# Altium schematic sheet 走线图3.SchDoc
size A3; PageSetup: Record=PageOptions|CenterHorizontal=True|CenterVertical=True|PrintScale=0.72|XCorrection=1.00|YCorrection=1.00|PrintKind=1|BorderSize=5000000|LeftOffset=0|BottomOffset=0|Orientation=1|PaperLength=1000|PaperWidth=1000|Scale=100|PaperSource=260|PrintQuality=600|MediaType=1|DitherType=10|PaperKind=A3|PrintScaleMode=1
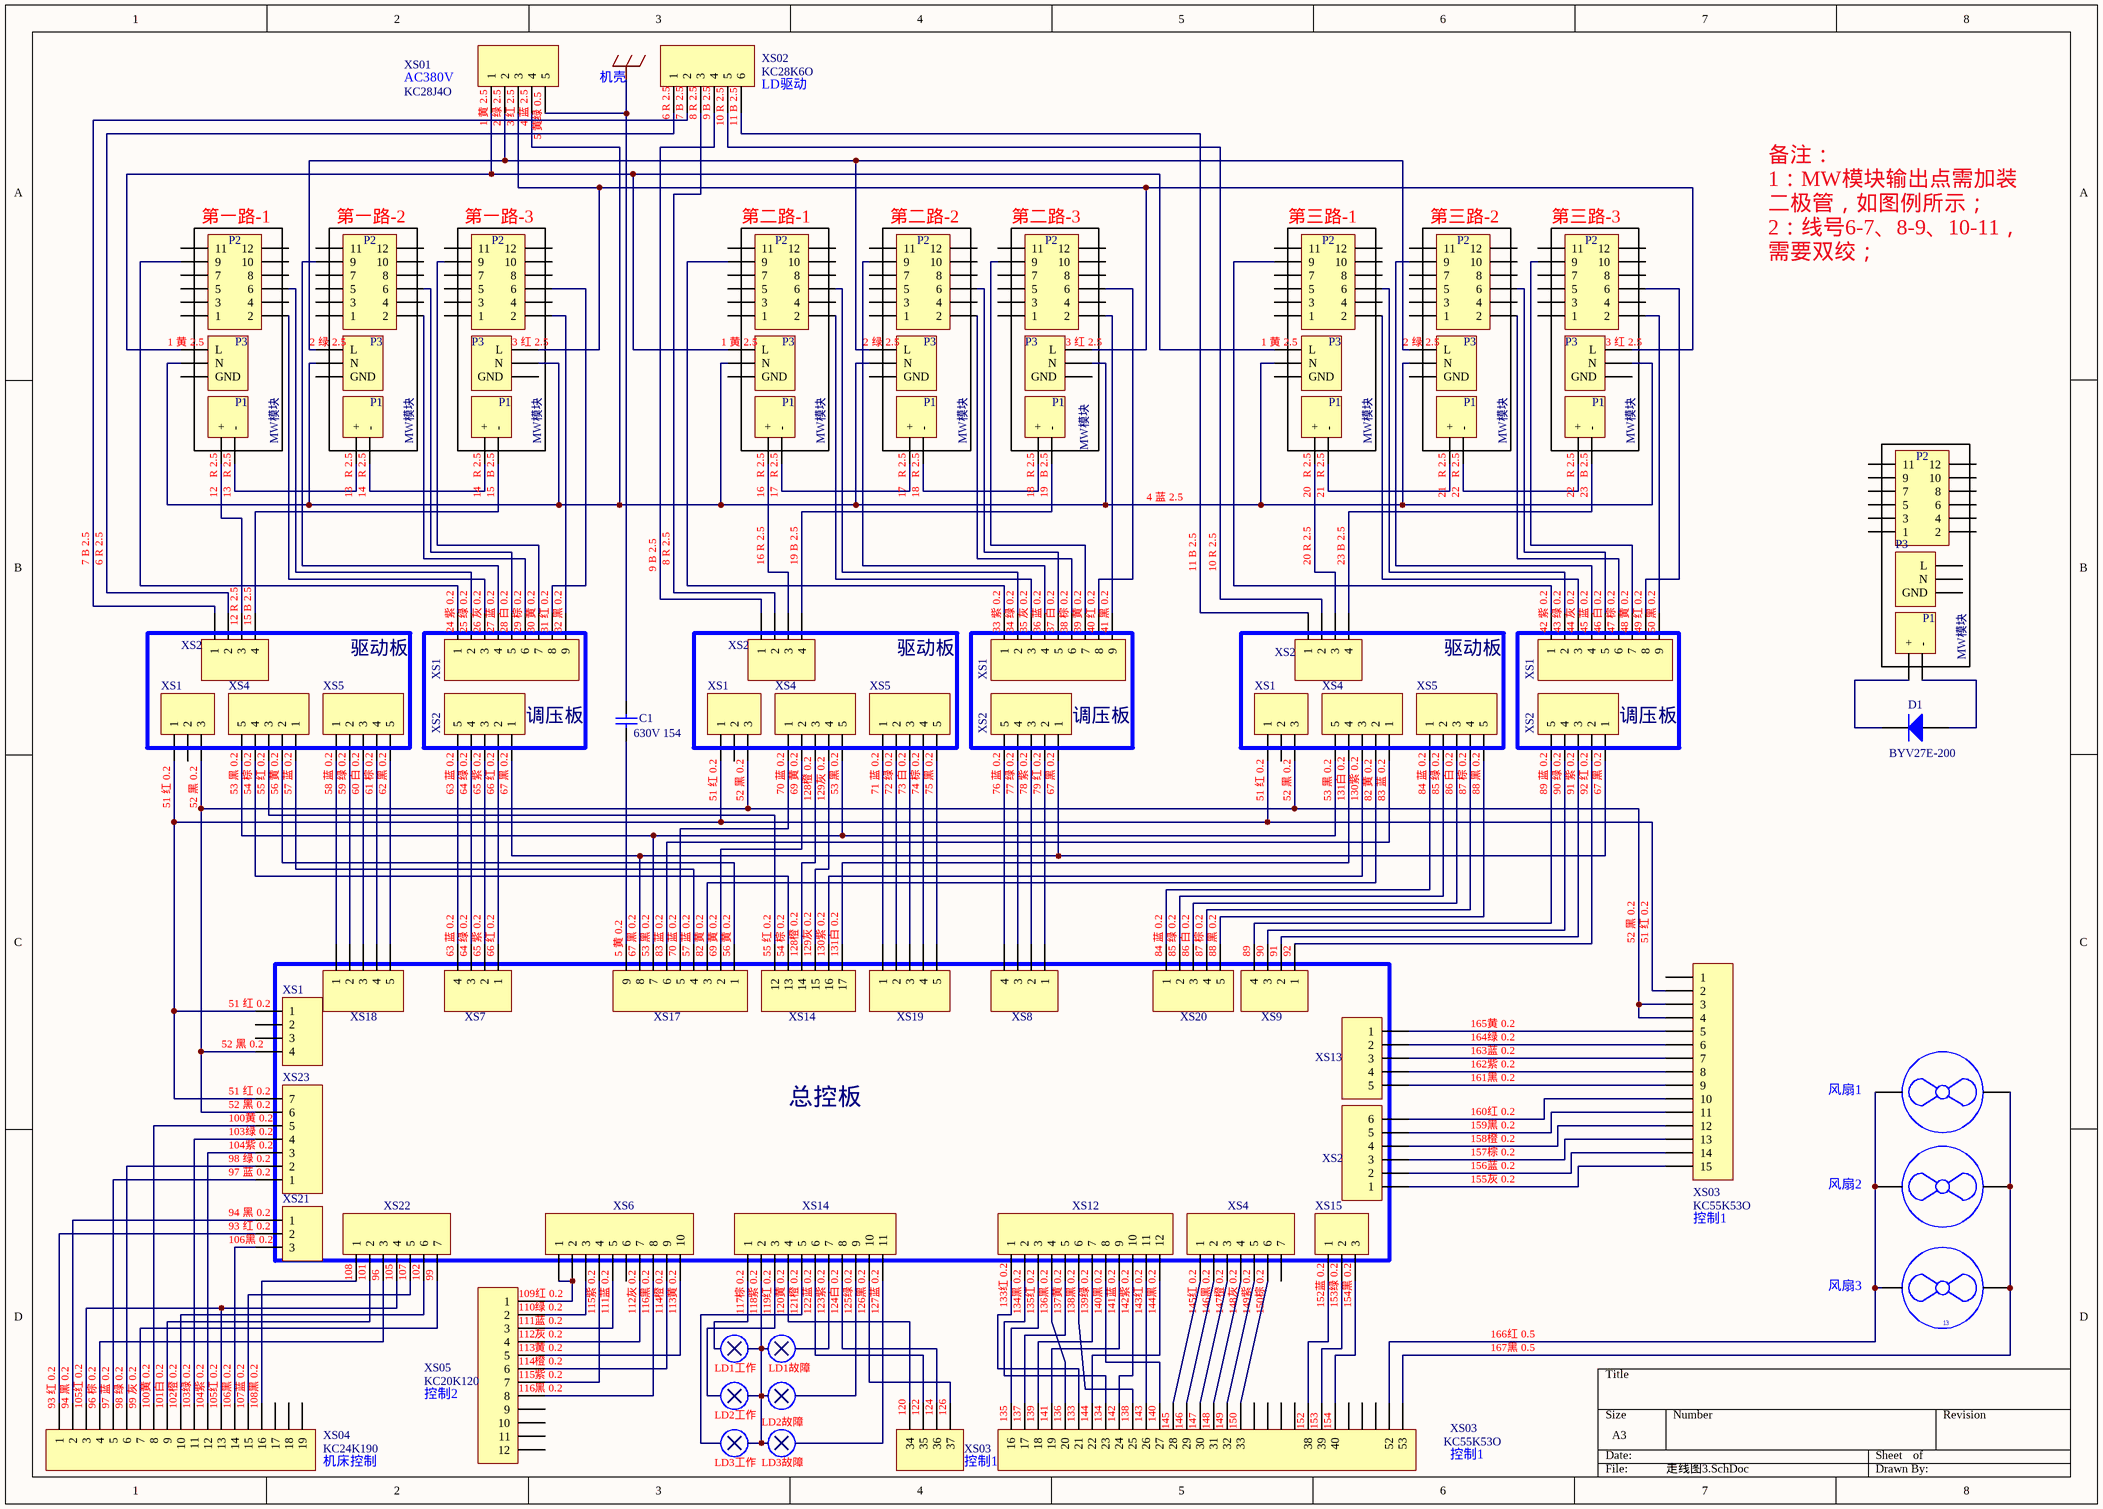
[diagram p0: 走线图3.SchDoc]

## Parts
(Parts that share a designator on the sheet are numbered #1, #2 ... from top to bottom, then left to right.)
?#1  (no value)
?#2  (no value)
?#3  (no value)
C1  value 630V 154  [RAD-0.3]  (hidden comment: Cap)
D1  BYV27E-200  [DIO18.84-9.6x5.6]
P1#1  Header 2  [HDR1X2]  (value not drawn)
P1#2  Header 2  [HDR1X2]  (value not drawn)
P1#3  Header 2  [HDR1X2]  (value not drawn)
P1#4  Header 2  [HDR1X2]  (value not drawn)
P1#5  Header 2  [HDR1X2]  (value not drawn)
P1#6  Header 2  [HDR1X2]  (value not drawn)
P1#7  Header 2  [HDR1X2]  (value not drawn)
P1#8  Header 2  [HDR1X2]  (value not drawn)
P1#9  Header 2  [HDR1X2]  (value not drawn)
P1#10  Header 2  [HDR1X2]  (value not drawn)
P2#1  Header 6X2H  [HDR2X6H]  (value not drawn)
P2#2  Header 6X2H  [HDR2X6H]  (value not drawn)
P2#3  Header 6X2H  [HDR2X6H]  (value not drawn)
P2#4  Header 6X2H  [HDR2X6H]  (value not drawn)
P2#5  Header 6X2H  [HDR2X6H]  (value not drawn)
P2#6  Header 6X2H  [HDR2X6H]  (value not drawn)
P2#7  Header 6X2H  [HDR2X6H]  (value not drawn)
P2#8  Header 6X2H  [HDR2X6H]  (value not drawn)
P2#9  Header 6X2H  [HDR2X6H]  (value not drawn)
P2#10  Header 6X2H  [HDR2X6H]  (value not drawn)
P3#1  Header 3  [HDR1X3]  (value not drawn)
P3#2  Header 3  [HDR1X3]  (value not drawn)
P3#3  Header 3  [HDR1X3]  (value not drawn)
P3#4  Header 3  [HDR1X3]  (value not drawn)
P3#5  Header 3  [HDR1X3]  (value not drawn)
P3#6  Header 3  [HDR1X3]  (value not drawn)
P3#7  Header 3  [HDR1X3]  (value not drawn)
P3#8  Header 3  [HDR1X3]  (value not drawn)
P3#9  Header 3  [HDR1X3]  (value not drawn)
P3#10  Header 3  [HDR1X3]  (value not drawn)
XS01  KC28J4O  [HDR1X5]
XS1#1  Header 9  [HDR1X9]  (value not drawn)
XS1#2  Header 9  [HDR1X9]  (value not drawn)
XS1#3  Header 9  [HDR1X9]  (value not drawn)
XS1#4  Header 3  [HDR1X3]  (value not drawn)
XS1#5  Header 3  [HDR1X3]  (value not drawn)
XS1#6  Header 3  [HDR1X3]  (value not drawn)
XS1#7  Header 4  [HDR1X4]  (value not drawn)
XS02  KC28K6O  [HDR1X6]
XS2#1  Header 4  [HDR1X4]  (value not drawn)
XS2#2  Header 4  [HDR1X4]  (value not drawn)
XS2#3  Header 4  [HDR1X4]  (value not drawn)
XS2#4  Header 5  [HDR1X5]  (value not drawn)
XS2#5  Header 5  [HDR1X5]  (value not drawn)
XS2#6  Header 5  [HDR1X5]  (value not drawn)
XS2#7  Header 6  [HDR1X6]  (value not drawn)
XS03#1  KC55K53O  [HDR1X15]
XS03#2  Header 4  [HDR1X4]  (value not drawn)
XS03#3  KC55K53O  [HDR1X30]
XS04  KC24K190  [HDR1X19]
XS4#1  Header 5  [HDR1X5]  (value not drawn)
XS4#2  Header 5  [HDR1X5]  (value not drawn)
XS4#3  Header 5  [HDR1X5]  (value not drawn)
XS4#4  Header 7  [HDR1X7]  (value not drawn)
XS05  KC20K120  [HDR1X12]
XS5#1  Header 5  [HDR1X5]  (value not drawn)
XS5#2  Header 5  [HDR1X5]  (value not drawn)
XS5#3  Header 5  [HDR1X5]  (value not drawn)
XS6  Header 10  [HDR1X10]  (value not drawn)
XS7  Header 4  [HDR1X4]  (value not drawn)
XS8  Header 4  [HDR1X4]  (value not drawn)
XS9  Header 4  [HDR1X4]  (value not drawn)
XS12  Header 12  [HDR1X12]  (value not drawn)
XS13  Header 5  [HDR1X5]  (value not drawn)
XS14#1  Header 6  [HDR1X6]  (value not drawn)
XS14#2  Header 11  [HDR1X11]  (value not drawn)
XS15  Header 3  [HDR1X3]  (value not drawn)
XS17  Header 9  [HDR1X9]  (value not drawn)
XS18  Header 5  [HDR1X5]  (value not drawn)
XS19  Header 5  [HDR1X5]  (value not drawn)
XS20  Header 5  [HDR1X5]  (value not drawn)
XS21  Header 3  [HDR1X3]  (value not drawn)
XS22  Header 7  [HDR1X7]  (value not drawn)
XS23  Header 7  [HDR1X7]  (value not drawn)

## Blocks framed on the sheet
第一路-1: P1#1 P2#1 P3#1
第一路-2: P1#2 P2#2 P3#2
第一路-3: P1#3 P2#3 P3#3
第二路-1: P1#4 P2#4 P3#4
第二路-2: P1#5 P2#5 P3#5
第二路-3: P1#6 P2#6 P3#6
第三路-1: P1#7 P2#7 P3#7
第三路-2: P1#8 P2#8 P3#8
第三路-3: P1#9 P2#9 P3#9
驱动板: XS1#4 XS2#1 XS4#1 XS5#1
调压板: XS1#1 XS2#4
驱动板: XS1#5 XS2#2 XS4#2 XS5#2
调压板: XS1#2 XS2#5
驱动板: XS1#6 XS2#3 XS4#3 XS5#3
调压板: XS1#3 XS2#6
总控板: XS1#7 XS2#7 XS4#4 XS6-XS9 XS12 XS13 XS14#1 XS14#2 XS15 XS17-XS23

## Nets
VSS: C1.2 XS01.5
Net?#1_9: ?#1.9 ?#2.9 ?#3.9 XS03#3.29(52)
Net?#1_10: ?#1.10 ?#2.10 ?#3.10 XS03#3.30(53)
NetC1_1: C1.1 XS17.9
NetD1_1: D1.1(A) P1#10.2(-)
NetD1_2: D1.2(K) P1#10.1(+)
NetP1#1_1: P1#1.1(+) XS2#1.3
NetP1#1_2: P1#1.2(-) P1#2.1(+)
NetP1#2_2: P1#2.2(-) P1#3.1(+)
NetP1#3_2: P1#3.2(-) XS2#1.4
NetP1#4_1: P1#4.1(+) XS2#2.3
NetP1#4_2: P1#4.2(-) P1#5.1(+)
NetP1#5_2: P1#5.2(-) P1#6.1(+)
NetP1#6_2: P1#6.2(-) XS2#2.4
NetP1#7_1: P1#7.1(+) XS2#3.3
NetP1#7_2: P1#7.2(-) P1#8.1(+)
NetP1#8_2: P1#8.2(-) P1#9.1(+)
NetP1#9_2: P1#9.2(-) XS2#3.4
NetP2#1_2: P2#1.2 XS1#1.3
NetP2#1_6: P2#1.6 XS1#1.2
NetP2#1_9: P2#1.9 XS1#1.1
NetP2#2_2: P2#2.2 XS1#1.6
NetP2#2_6: P2#2.6 XS1#1.5
NetP2#2_9: P2#2.9 XS1#1.4
NetP2#3_2: P2#3.2 XS1#1.9
NetP2#3_6: P2#3.6 XS1#1.8
NetP2#3_9: P2#3.9 XS1#1.7
NetP2#4_2: P2#4.2 XS1#2.3
NetP2#4_6: P2#4.6 XS1#2.2
NetP2#4_9: P2#4.9 XS1#2.1
NetP2#5_2: P2#5.2 XS1#2.6
NetP2#5_6: P2#5.6 XS1#2.5
NetP2#5_9: P2#5.9 XS1#2.4
NetP2#6_2: P2#6.2 XS1#2.9
NetP2#6_6: P2#6.6 XS1#2.8
NetP2#6_9: P2#6.9 XS1#2.7
NetP2#7_2: P2#7.2 XS1#3.3
NetP2#7_6: P2#7.6 XS1#3.2
NetP2#7_9: P2#7.9 XS1#3.1
NetP2#8_2: P2#8.2 XS1#3.6
NetP2#8_6: P2#8.6 XS1#3.5
NetP2#8_9: P2#8.9 XS1#3.4
NetP2#9_2: P2#9.2 XS1#3.9
NetP2#9_6: P2#9.6 XS1#3.8
NetP2#9_9: P2#9.9 XS1#3.7
NetP3#1_1: P3#1.1(L) P3#4.1(L) P3#7.1(L) XS01.1
NetP3#1_2: P3#1.2(N) P3#2.2(N) P3#3.2(N) P3#4.2(N) P3#5.2(N) P3#6.2(N) P3#7.2(N) P3#8.2(N) P3#9.2(N) XS01.4
NetP3#2_1: P3#2.1(L) P3#5.1(L) P3#8.1(L) XS01.2
NetP3#3_1: P3#3.1(L) P3#6.1(L) P3#9.1(L) XS01.3
NetXS1#4_1: XS1#4.1 XS1#5.1 XS1#6.1 XS1#7.1 XS03#1.2 XS23.7
NetXS1#4_3: XS1#4.3 XS1#5.3 XS1#6.3 XS1#7.4 XS03#1.3 XS03#1.4 XS23.6
NetXS2#4_1: XS2#4.1 XS2#5.1 XS2#6.1 XS17.8
NetXS2#4_2: XS2#4.2 XS7.1
NetXS2#4_3: XS2#4.3 XS7.2
NetXS2#4_4: XS2#4.4 XS7.3
NetXS2#4_5: XS2#4.5 XS7.4
NetXS2#5_2: XS2#5.2 XS8.1
NetXS2#5_3: XS2#5.3 XS8.2
NetXS2#5_4: XS2#5.4 XS8.3
NetXS2#5_5: XS2#5.5 XS8.4
NetXS2#6_2: XS2#6.2 XS9.1
NetXS2#6_3: XS2#6.3 XS9.2
NetXS2#6_4: XS2#6.4 XS9.3
NetXS2#6_5: XS2#6.5 XS9.4
NetXS2#7_1: XS2#7.1 XS03#1.15
NetXS2#7_2: XS2#7.2 XS03#1.14
NetXS2#7_3: XS2#7.3 XS03#1.13
NetXS2#7_4: XS2#7.4 XS03#1.12
NetXS2#7_5: XS2#7.5 XS03#1.11
NetXS2#7_6: XS2#7.6 XS03#1.10
NetXS02_1: XS02.1 XS2#1.2
NetXS02_2: XS02.2 XS2#1.1
NetXS02_3: XS02.3 XS2#2.2
NetXS02_4: XS02.4 XS2#2.1
NetXS02_5: XS02.5 XS2#3.2
NetXS02_6: XS02.6 XS2#3.1
NetXS03#1_5: XS03#1.5 XS13.1
NetXS03#1_6: XS03#1.6 XS13.2
NetXS03#1_7: XS03#1.7 XS13.3
NetXS03#1_8: XS03#1.8 XS13.4
NetXS03#1_9: XS03#1.9 XS13.5
NetXS03#2_1: XS03#2.1(34) XS14#2.4
NetXS03#2_2: XS03#2.2(35) XS14#2.6
NetXS03#2_3: XS03#2.3(36) XS14#2.8
NetXS03#2_4: XS03#2.4(37) XS14#2.10
NetXS03#3_1: XS03#3.1(16) XS12.3
NetXS03#3_2: XS03#3.2(17) XS12.5
NetXS03#3_3: XS03#3.3(18) XS12.7
NetXS03#3_4: XS03#3.4(19) XS12.9
NetXS03#3_5: XS03#3.5(20) XS12.4
NetXS03#3_6: XS03#3.6(21) XS12.1
NetXS03#3_7: XS03#3.7(22) XS12.12
NetXS03#3_8: XS03#3.8(23) XS12.2
NetXS03#3_9: XS03#3.9(24) XS12.10
NetXS03#3_10: XS03#3.10(25) XS12.6
NetXS03#3_11: XS03#3.11(26) XS12.11
NetXS03#3_12: XS03#3.12(27) XS12.8
NetXS03#3_13: XS03#3.13(28) XS4#4.1
NetXS03#3_14: XS03#3.14(29) XS4#4.2
NetXS03#3_15: XS03#3.15(30) XS4#4.3
NetXS03#3_16: XS03#3.16(31) XS4#4.4
NetXS03#3_17: XS03#3.17(32) XS4#4.5
NetXS03#3_18: XS03#3.18(33) XS4#4.6
NetXS03#3_23: XS03#3.23(38) XS15.1
NetXS03#3_24: XS03#3.24(39) XS15.2
NetXS03#3_25: XS03#3.25(40) XS15.3
NetXS4#1_1: XS4#1.1 XS17.4
NetXS4#1_2: XS4#1.2 XS17.1
NetXS4#1_3: XS4#1.3 XS14#1.1(12)
NetXS4#1_4: XS4#1.4 XS14#1.2(13)
NetXS4#1_5: XS4#1.5 XS4#2.5 XS4#3.5 XS17.7
NetXS4#2_1: XS4#2.1 XS17.5
NetXS4#2_2: XS4#2.2 XS17.2
NetXS4#2_3: XS4#2.3 XS14#1.3(14)
NetXS4#2_4: XS4#2.4 XS14#1.4(15)
NetXS4#3_1: XS4#3.1 XS17.6
NetXS4#3_2: XS4#3.2 XS17.3
NetXS4#3_3: XS4#3.3 XS14#1.5(16)
NetXS4#3_4: XS4#3.4 XS14#1.6(17)
NetXS04_1: XS04.1 XS21.2
NetXS04_2: XS04.2 XS21.1
NetXS04_3: XS04.3 XS04.13 XS22.4
NetXS04_4: XS04.4 XS22.3
NetXS04_5: XS04.5 XS23.1
NetXS04_6: XS04.6 XS23.2
NetXS04_7: XS04.7 XS22.7
NetXS04_8: XS04.8 XS23.5
NetXS04_9: XS04.9 XS22.2
NetXS04_10: XS04.10 XS22.6
NetXS04_11: XS04.11 XS23.4
NetXS04_12: XS04.12 XS23.3
NetXS04_14: XS04.14 XS21.3
NetXS04_15: XS04.15 XS22.5
NetXS04_16: XS04.16 XS22.1
NetXS5#1_1: XS5#1.1 XS18.1
NetXS5#1_2: XS5#1.2 XS18.2
NetXS5#1_3: XS5#1.3 XS18.3
NetXS5#1_4: XS5#1.4 XS18.4
NetXS5#1_5: XS5#1.5 XS18.5
NetXS5#2_1: XS5#2.1 XS19.1
NetXS5#2_2: XS5#2.2 XS19.2
NetXS5#2_3: XS5#2.3 XS19.3
NetXS5#2_4: XS5#2.4 XS19.4
NetXS5#2_5: XS5#2.5 XS19.5
NetXS5#3_1: XS5#3.1 XS20.1
NetXS5#3_2: XS5#3.2 XS20.2
NetXS5#3_3: XS5#3.3 XS20.3
NetXS5#3_4: XS5#3.4 XS20.4
NetXS5#3_5: XS5#3.5 XS20.5
NetXS05_1: XS05.1 XS6.1 XS6.2
NetXS05_2: XS05.2 XS6.3
NetXS05_3: XS05.3 XS6.5
NetXS05_4: XS05.4 XS6.7
NetXS05_5: XS05.5 XS6.10
NetXS05_6: XS05.6 XS6.9
NetXS05_7: XS05.7 XS6.4
NetXS05_8: XS05.8 XS6.8

Not connected (* = marked no-connect by the designer): P2#1 1 3 4 5 7 8 10 11 12; P2#2 1 3 4 5 7 8 10 11 12; P2#3 1 3 4 5 7 8 10 11 12; P2#4 1 3 4 5 7 8 10 11 12; P2#5 1 3 4 5 7 8 10 11 12; P2#6 1 3 4 5 7 8 10 11 12; P2#7 1 3 4 5 7 8 10 11 12; P2#8 1 3 4 5 7 8 10 11 12; P2#9 1 3 4 5 7 8 10 11 12; P2#10 1 2 3 4 5 6 7 8 9 10 11 12; P3#1 3(GND); P3#2 3(GND); P3#3 3(GND); P3#4 3(GND); P3#5 3(GND); P3#6 3(GND); P3#7 3(GND); P3#8 3(GND); P3#9 3(GND); P3#10 1(L) 2(N) 3(GND); XS1#4 2; XS1#5 2; XS1#6 2; XS1#7 2 3; XS03#1 1; XS03#3 19 20 21 22 26 27 28; XS04 17 18 19; XS4#4 7; XS05 9 10 11 12; XS6 6; XS14#2 1 2 3 5 7 9 11

## Notes on the sheet
- (near XS01) AC380V
- 机壳
- (near XS02) LD驱动
- (near XS01) 1 黄 2.5
- (near XS01) 2 绿 2.5
- (near XS01) 3 红 2.5
- (near XS01) 4 蓝 2.5
- (near XS01) 5 黄绿 0.5
- (near XS02) 6 R 2.5
- (near XS02) 7 B 2.5
- (near XS02) 8 R 2.5
- (near XS02) 9 B 2.5
- (near XS02) 10 R 2.5
- (near XS02) 11 B 2.5
- (near P3#1) 1 黄 2.5
- (near P3#2) 2 绿 2.5
- (near P3#3) 3 红 2.5
- (near P3#4) 1 黄 2.5
- (near P3#5) 2 绿 2.5
- (near P3#6) 3 红 2.5
- (near P3#7) 1 黄 2.5
- (near P3#8) 2 绿 2.5
- (near P3#9) 3 红 2.5
- (near P1#1) MW模块
- (near P1#2) MW模块
- MW模块
- (near P1#4) MW模块
- (near P1#5) MW模块
- (near P1#6) MW模块
- (near P1#7) MW模块
- (near P1#8) MW模块
- 备注：
  1：MW模块输出点需加装二极管，如图例所示；
  2：线号6-7、8-9、10-11，需要双绞；
- (near P1#1) 12   R 2.5
- (near P1#1) 13   R 2.5
- (near P1#2) 13   R 2.5
- (near P1#2) 14   R 2.5
- (near P1#3) 14   R 2.5
- (near P1#3) 15   B 2.5
- (near P1#4) 16   R 2.5
- (near P1#4) 17   R 2.5
- (near P1#5) 17   R 2.5
- (near P1#5) 18   R 2.5
- (near P1#6) 18   R 2.5
- (near P1#6) 19   B 2.5
- 4 蓝 2.5
- (near P1#7) 20   R 2.5
- (near P1#7) 21   R 2.5
- (near P1#8) 21   R 2.5
- (near P1#8) 22   R 2.5
- (near P1#9) 22   R 2.5
- (near P1#9) 23   B 2.5
- 7 B 2.5
- 6 R 2.5
- 9 B 2.5
- 8 R 2.5
- 16 R 2.5
- 19 B 2.5
- 11 B 2.5
- 10 R 2.5
- 20 R 2.5
- 23 B 2.5
- (near XS2#1) 12 R 2.5
- (near XS2#1) 15 B 2.5
- (near XS1#1) 24 紫 0.2
- (near XS1#1) 25 绿 0.2
- (near XS1#1) 26 灰 0.2
- (near XS1#1) 27 蓝 0.2
- (near XS1#1) 28 白 0.2
- (near XS1#1) 29 棕 0.2
- (near XS1#1) 30 黄 0.2
- (near XS1#1) 31 红 0.2
- (near XS1#1) 32 黑 0.2
- (near XS1#2) 33 紫 0.2
- (near XS1#2) 34 绿 0.2
- (near XS1#2) 35 灰 0.2
- (near XS1#2) 36 蓝 0.2
- (near XS1#2) 37 白 0.2
- (near XS1#2) 38 棕 0.2
- (near XS1#2) 39 黄 0.2
- (near XS1#2) 40 红 0.2
- (near XS1#2) 41 黑 0.2
- (near XS1#3) 42 紫 0.2
- (near XS1#3) 43 绿 0.2
- (near XS1#3) 44 灰 0.2
- (near XS1#3) 45 蓝 0.2
- (near XS1#3) 46 白 0.2
- (near XS1#3) 47 棕 0.2
- (near XS1#3) 48 黄 0.2
- (near XS1#3) 49 红 0.2
- (near XS1#3) 50 黑 0.2
- (near XS1#4) 51 红 0.2
- (near XS1#4) 52 黑 0.2
- (near XS4#1) 53 黑 0.2
- (near XS4#1) 54 棕 0.2
- (near XS4#1) 55 红 0.2
- (near XS4#1) 56 黄 0.2
- (near XS4#1) 57 蓝 0.2
- (near XS5#1) 58 蓝 0.2
- (near XS5#1) 59 绿 0.2
- (near XS5#1) 60 白 0.2
- (near XS5#1) 61 棕 0.2
- (near XS5#1) 62 黑 0.2
- (near XS2#4) 63 蓝 0.2
- (near XS2#4) 64 绿 0.2
- (near XS2#4) 65 紫 0.2
- (near XS2#4) 66 红 0.2
- (near XS2#4) 67 黑 0.2
- (near XS1#5) 51 红 0.2
- (near XS1#5) 52 黑 0.2
- (near XS4#2) 70 蓝 0.2
- (near XS4#2) 69 黄 0.2
- (near XS4#2) 128橙 0.2
- (near XS4#2) 129灰 0.2
- (near XS4#2) 53 黑 0.2
- (near XS5#2) 71 蓝 0.2
- (near XS5#2) 72 绿 0.2
- (near XS5#2) 73 白 0.2
- (near XS5#2) 74 棕 0.2
- (near XS5#2) 75 黑 0.2
- (near XS2#5) 76 蓝 0.2
- (near XS2#5) 77 绿 0.2
- (near XS2#5) 78 紫 0.2
- (near XS2#5) 79 红 0.2
- (near XS2#5) 67 黑 0.2
- (near XS1#6) 51 红 0.2
- (near XS1#6) 52 黑 0.2
- 53 黑 0.2
- (near XS4#3) 131白 0.2
- (near XS4#3) 130紫 0.2
- (near XS4#3) 82 黄 0.2
- (near XS4#3) 83 蓝 0.2
- (near XS5#3) 84 蓝 0.2
- (near XS5#3) 85 绿 0.2
- (near XS5#3) 86 白 0.2
- (near XS5#3) 87 棕 0.2
- (near XS5#3) 88 黑 0.2
- (near XS2#6) 89 蓝 0.2
- (near XS2#6) 90 绿 0.2
- (near XS2#6) 91 紫 0.2
- (near XS2#6) 92 红 0.2
- (near XS2#6) 67 黑 0.2
- (near XS7) 63 蓝 0.2
- (near XS7) 64 绿 0.2
- (near XS7) 65 紫 0.2
- (near XS7) 66 红 0.2
- (near XS17) 5 黄 0.2
- (near XS17) 67 黑 0.2
- (near XS17) 53 黑 0.2
- (near XS17) 83 蓝 0.2
- (near XS17) 70 蓝 0.2
- (near XS17) 57 蓝 0.2
- (near XS17) 82 黄 0.2
- (near XS17) 69 黄 0.2
- (near XS17) 56 黄 0.2
- (near XS14#1) 55 红 0.2
- (near XS14#1) 54 棕 0.2
- (near XS14#1) 128橙 0.2
- (near XS14#1) 129灰 0.2
- (near XS14#1) 130紫 0.2
- (near XS14#1) 131白 0.2
- (near XS20) 84 蓝 0.2
- (near XS20) 85 绿 0.2
- (near XS20) 86 白 0.2
- (near XS20) 87 棕 0.2
- (near XS20) 88 黑 0.2
- (near XS9) 89
- (near XS9) 90
- (near XS9) 91
- (near XS9) 92
- 52 黑 0.2
- (near XS03#1) 51 红 0.2
- (near XS1#7) 52 黑 0.2
- (near XS1#7) 51 红 0.2
- 163蓝 0.2
- 164绿 0.2
- 165黄 0.2
- (near XS23) 51 红 0.2
- (near XS23) 52 黑 0.2
- (near XS23) 100黄 0.2
- 159黑 0.2
- 160红 0.2
- 161黑 0.2
- 162紫 0.2
- 风扇1
- (near XS23) 97 蓝 0.2
- (near XS23) 98 绿 0.2
- (near XS23) 104紫 0.2
- (near XS23) 103绿 0.2
- 157棕 0.2
- 158橙 0.2
- 155灰 0.2
- 156蓝 0.2
- 风扇2
- (near XS21) 106黑 0.2
- (near XS21) 93 红 0.2
- (near XS21) 94 黑 0.2
- (near XS03#1) 控制1
- (near XS22) 108
- (near XS22) 101
- (near XS22) 96
- (near XS22) 105
- (near XS22) 107
- (near XS22) 102
- (near XS22) 99
- (near XS05) 109红 0.2
- (near XS05) 110绿 0.2
- (near XS05) 111蓝 0.2
- (near XS6) 115紫 0.2
- (near XS6) 111蓝 0.2
- (near XS6) 112灰 0.2
- (near XS6) 116黑 0.2
- (near XS6) 114橙 0.2
- (near XS6) 113黄 0.2
- (near XS14#2) 117棕 0.2
- (near XS14#2) 118紫 0.2
- (near XS14#2) 119红 0.2
- (near XS14#2) 120黄 0.2
- (near XS14#2) 121橙 0.2
- (near XS14#2) 122蓝 0.2
- (near XS14#2) 123紫 0.2
- (near XS14#2) 124白 0.2
- (near XS14#2) 125绿 0.2
- (near XS14#2) 126黑 0.2
- (near XS14#2) 127蓝 0.2
- (near XS12) 133红 0.2
- (near XS12) 134黑 0.2
- (near XS12) 135红 0.2
- (near XS12) 136黑 0.2
- (near XS12) 137黄 0.2
- (near XS12) 138黑 0.2
- (near XS12) 139绿 0.2
- (near XS12) 140黑 0.2
- (near XS12) 141蓝 0.2
- (near XS12) 142紫 0.2
- (near XS12) 143红 0.2
- (near XS12) 144黑 0.2
- (near XS4#4) 145红 0.2
- (near XS4#4) 146黑 0.2
- (near XS4#4) 147橙 0.2
- (near XS4#4) 148灰 0.2
- (near XS4#4) 149紫 0.2
- (near XS4#4) 150棕 0.2
- (near XS15) 152蓝 0.2
- (near XS15) 153绿 0.2
- (near XS15) 154黑 0.2
- 风扇3
- 13
- 控制2
- (near XS05) 112灰 0.2
- (near XS05) 113黄 0.2
- (near XS05) 114橙 0.2
- (near XS05) 115紫 0.2
- (near XS05) 116黑 0.2
- LD1工作
- LD1故障
- 166红 0.5
- 167黑 0.5
- (near XS04) 93 红 0.2
- (near XS04) 94 黑 0.2
- (near XS04) 105红 0.2
- (near XS04) 96 棕 0.2
- (near XS04) 97 蓝 0.2
- (near XS04) 98 绿 0.2
- (near XS04) 99 灰 0.2
- (near XS04) 100黄 0.2
- (near XS04) 101白 0.2
- (near XS04) 102橙 0.2
- (near XS04) 103绿 0.2
- (near XS04) 104紫 0.2
- (near XS04) 106黑 0.2
- (near XS04) 107蓝 0.2
- (near XS04) 108黑 0.2
- LD2工作
- LD2故障
- (near XS03#2) 120
- (near XS03#2) 122
- (near XS03#2) 124
- (near XS03#2) 126
- (near XS03#3) 135
- (near XS03#3) 137
- (near XS03#3) 139
- (near XS03#3) 141
- (near XS03#3) 136
- (near XS03#3) 133
- (near XS03#3) 144
- (near XS03#3) 134
- (near XS03#3) 142
- (near XS03#3) 138
- (near XS03#3) 143
- (near XS03#3) 140
- (near XS03#3) 145
- (near XS03#3) 146
- (near XS03#3) 147
- (near XS03#3) 148
- (near XS03#3) 149
- (near XS03#3) 150
- (near XS03#3) 152
- (near XS03#3) 153
- (near XS03#3) 154
- (near XS03#3) 控制1
- (near XS04) 机床控制
- LD3工作
- LD3故障
- (near XS03#2) 控制1

## Library data of the parts
?#1-?#3 = FAN1
C1 = Cap: Capacitor; Published: 8-Jun-2000; LatestRevisionDate: 17-Jul-2002; LatestRevisionNote: Re-released for DXP Platform.; PackageReference: RAD-0.3; Publisher: Altium Limited
D1 = Diode 1N5407: 3 Amp Medium Power Silicon Rectifier Diode; Published: 8-Jun-2000; LatestRevisionDate: 17-Jul-2002; LatestRevisionNote: Re-released for DXP Platform.; DatasheetVersion: Aug-1984; PackageReference: DO-201AD; Publisher: Altium Limited; ComponentLink1Description: Manufacturer Link; ComponentLink1URL: http://www.irf.com/
P1#1-P1#10 = Header 2: Header, 2-Pin; LatestRevisionDate: 17-Jul-2002; LatestRevisionNote: Re-released for DXP Platform.; Publisher: Altium Limited
P2#1-P2#10 = Header 6X2H: Header, 6-Pin, Dual row, Right Angle; LatestRevisionDate: 17-Jul-2002; LatestRevisionNote: Re-released for DXP Platform.; Publisher: Altium Limited
P3#1-P3#10 XS1#4-XS1#6 XS15 XS21 = Header 3: Header, 3-Pin; LatestRevisionDate: 17-Jul-2002; LatestRevisionNote: Re-released for DXP Platform.; Publisher: Altium Limited
XS01 XS2#4-XS2#6 XS4#1-XS4#3 XS5#1-XS5#3 XS13 XS18-XS20 = Header 5: Header, 5-Pin; LatestRevisionDate: 17-Jul-2002; LatestRevisionNote: Re-released for DXP Platform.; Publisher: Altium Limited
XS1#1-XS1#3 XS17 = Header 9: Header, 9-Pin; LatestRevisionDate: 17-Jul-2002; LatestRevisionNote: Re-released for DXP Platform.; Publisher: Altium Limited
XS1#7 XS2#1-XS2#3 XS03#2 XS7-XS9 = Header 4: Header, 4-Pin; LatestRevisionDate: 17-Jul-2002; LatestRevisionNote: Re-released for DXP Platform.; Publisher: Altium Limited
XS02 XS2#7 XS14#1 = Header 6: Header, 6-Pin; LatestRevisionDate: 17-Jul-2002; LatestRevisionNote: Re-released for DXP Platform.; Publisher: Altium Limited
XS03#1 = Header 15: Header, 15-Pin; LatestRevisionDate: 17-Jul-2002; LatestRevisionNote: Re-released for DXP Platform.; Publisher: Altium Limited
XS03#3 = Header 30: Header, 30-Pin; LatestRevisionDate: 17-Jul-2002; LatestRevisionNote: Re-released for DXP Platform.; Publisher: Altium Limited
XS04 = Header 19: Header, 19-Pin; LatestRevisionDate: 17-Jul-2002; LatestRevisionNote: Re-released for DXP Platform.; Publisher: Altium Limited
XS4#4 XS22 XS23 = Header 7: Header, 7-Pin; LatestRevisionDate: 17-Jul-2002; LatestRevisionNote: Re-released for DXP Platform.; Publisher: Altium Limited
XS05 XS12 = Header 12: Header, 12-Pin; LatestRevisionDate: 17-Jul-2002; LatestRevisionNote: Re-released for DXP Platform.; Publisher: Altium Limited
XS6 = Header 10: Header, 10-Pin; LatestRevisionDate: 17-Jul-2002; LatestRevisionNote: Re-released for DXP Platform.; Publisher: Altium Limited
XS14#2 = Header 11: Header, 11-Pin; LatestRevisionDate: 17-Jul-2002; LatestRevisionNote: Re-released for DXP Platform.; Publisher: Altium Limited